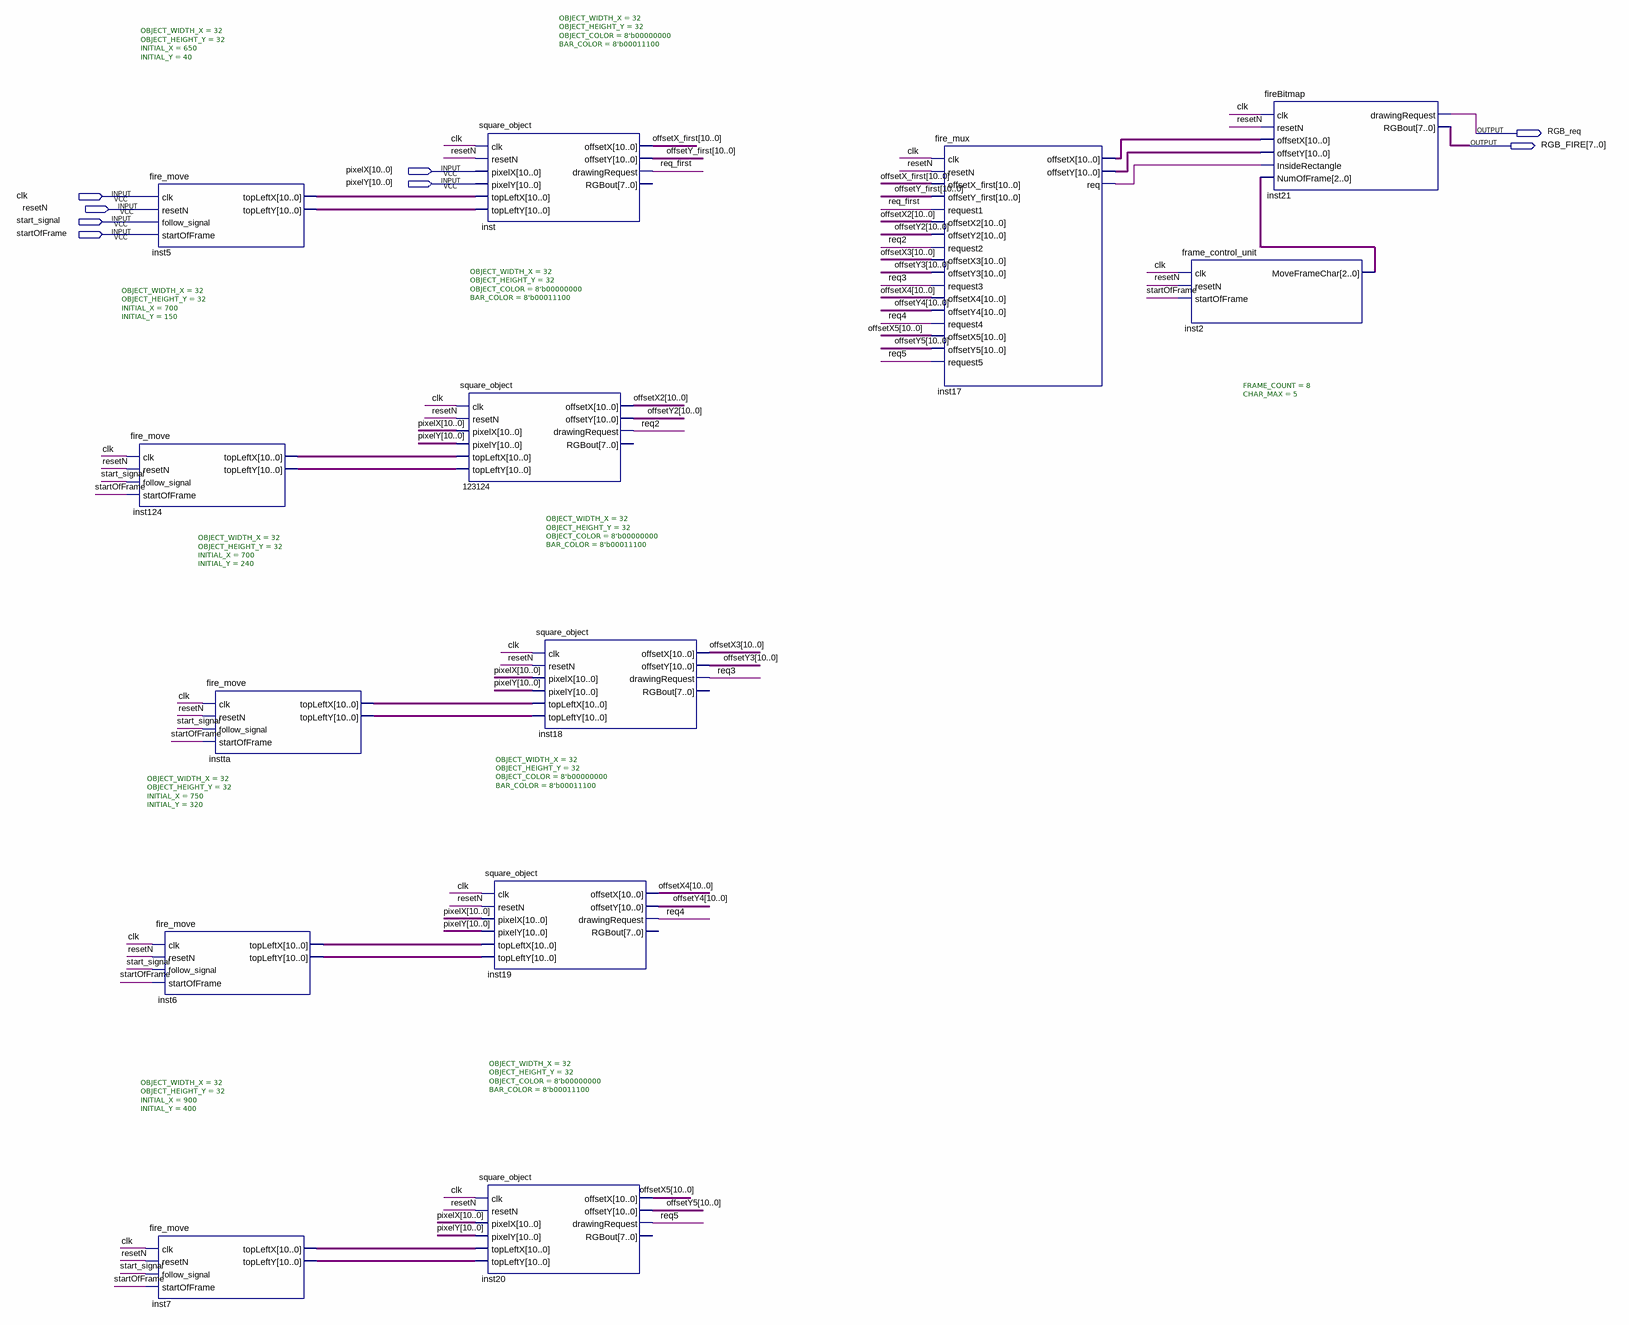
[diagram p0: schematic sheet]
// Quartus schematic fire_top.bdf as structural Verilog: 13 symbols, 8 pins
module fire_top (
  input  [10:0] pixelX,
  input  [10:0] pixelY,
  input  clk,
  input  resetN,
  input  start_signal,
  input  startOfFrame,
  output RGB_req,
  output [7:0] RGB_FIRE
);

  wire inst17_req, req2, req3, req4, req5, req_first;
  wire [2:0] inst2_moveframechar;
  wire [10:0] inst5_topleftx, inst5_toplefty, inst6_topleftx, inst6_toplefty, inst7_topleftx, inst7_toplefty,
       inst17_offsetx, inst17_offsety, inst124_topleftx, inst124_toplefty, instta_topleftx, instta_toplefty,
       offsetX2, offsetX3, offsetX4, offsetX5, offsetX_first, offsetY2, offsetY3, offsetY4, offsetY5,
       offsetY_first;

  fire_move #(.OBJECT_WIDTH_X(32), .OBJECT_HEIGHT_Y(32), .INITIAL_X(650), .INITIAL_Y(40)) inst5 (
    .clk(clk), .follow_signal(start_signal), .startOfFrame(startOfFrame), .topLeftX(inst5_topleftx),
    .topLeftY(inst5_toplefty));  // open: resetN
  fire_move #(.OBJECT_WIDTH_X(32), .OBJECT_HEIGHT_Y(32), .INITIAL_X(700), .INITIAL_Y(150)) inst124 (
    .clk(clk), .resetN(resetN), .follow_signal(start_signal), .startOfFrame(startOfFrame),
    .topLeftX(inst124_topleftx), .topLeftY(inst124_toplefty));
  fire_move #(.OBJECT_WIDTH_X(32), .OBJECT_HEIGHT_Y(32), .INITIAL_X(750), .INITIAL_Y(320)) inst6 (
    .clk(clk), .resetN(resetN), .follow_signal(start_signal), .startOfFrame(startOfFrame),
    .topLeftX(inst6_topleftx), .topLeftY(inst6_toplefty));
  fire_move #(.OBJECT_WIDTH_X(32), .OBJECT_HEIGHT_Y(32), .INITIAL_X(900), .INITIAL_Y(400)) inst7 (
    .clk(clk), .resetN(resetN), .follow_signal(start_signal), .startOfFrame(startOfFrame),
    .topLeftX(inst7_topleftx), .topLeftY(inst7_toplefty));
  fire_move #(.OBJECT_WIDTH_X(32), .OBJECT_HEIGHT_Y(32), .INITIAL_X(700), .INITIAL_Y(240)) instta (
    .clk(clk), .resetN(resetN), .follow_signal(start_signal), .startOfFrame(startOfFrame),
    .topLeftX(instta_topleftx), .topLeftY(instta_toplefty));
  square_object #(.OBJECT_WIDTH_X(32), .OBJECT_HEIGHT_Y(32), .OBJECT_COLOR(8'b00000000), .BAR_COLOR(8'b00011100)) u_123124 (
    .clk(clk), .resetN(resetN), .pixelX(pixelX), .pixelY(pixelY), .topLeftX(inst124_topleftx),
    .topLeftY(inst124_toplefty), .offsetX(offsetX2), .offsetY(offsetY2), .drawingRequest(req2));  // open: RGBout
  square_object #(.OBJECT_WIDTH_X(32), .OBJECT_HEIGHT_Y(32), .OBJECT_COLOR(8'b00000000), .BAR_COLOR(8'b00011100)) inst (
    .clk(clk), .resetN(resetN), .pixelX(pixelX), .pixelY(pixelY), .topLeftX(inst5_topleftx),
    .topLeftY(inst5_toplefty), .offsetX(offsetX_first), .offsetY(offsetY_first), .drawingRequest(req_first));  // open: RGBout
  square_object #(.OBJECT_WIDTH_X(32), .OBJECT_HEIGHT_Y(32), .OBJECT_COLOR(8'b00000000), .BAR_COLOR(8'b00011100)) inst19 (
    .clk(clk), .resetN(resetN), .pixelX(pixelX), .pixelY(pixelY), .topLeftX(inst6_topleftx),
    .topLeftY(inst6_toplefty), .offsetX(offsetX4), .offsetY(offsetY4), .drawingRequest(req4));  // open: RGBout
  square_object #(.OBJECT_WIDTH_X(32), .OBJECT_HEIGHT_Y(32), .OBJECT_COLOR(8'b00000000), .BAR_COLOR(8'b00011100)) inst20 (
    .clk(clk), .resetN(resetN), .pixelX(pixelX), .pixelY(pixelY), .topLeftX(inst7_topleftx),
    .topLeftY(inst7_toplefty), .offsetX(offsetX5), .offsetY(offsetY5), .drawingRequest(req5));  // open: RGBout
  square_object #(.OBJECT_WIDTH_X(32), .OBJECT_HEIGHT_Y(32), .OBJECT_COLOR(8'b00000000), .BAR_COLOR(8'b00011100)) inst18 (
    .clk(clk), .resetN(resetN), .pixelX(pixelX), .pixelY(pixelY), .topLeftX(instta_topleftx),
    .topLeftY(instta_toplefty), .offsetX(offsetX3), .offsetY(offsetY3), .drawingRequest(req3));  // open: RGBout
  fire_mux inst17 (
    .clk(clk), .resetN(resetN), .offsetX_first(offsetX_first), .offsetY_first(offsetY_first),
    .request1(req_first), .offsetX2(offsetX2), .offsetY2(offsetY2), .request2(req2), .offsetX3(offsetX3),
    .offsetY3(offsetY3), .request3(req3), .offsetX4(offsetX4), .offsetY4(offsetY4), .request4(req4),
    .offsetX5(offsetX5), .offsetY5(offsetY5), .request5(req5), .offsetX(inst17_offsetx),
    .offsetY(inst17_offsety), .req(inst17_req));
  frame_control_unit #(.FRAME_COUNT(8), .CHAR_MAX(5)) inst2 (
    .clk(clk), .resetN(resetN), .startOfFrame(startOfFrame), .MoveFrameChar(inst2_moveframechar));
  fireBitmap inst21 (
    .clk(clk), .resetN(resetN), .offsetX(inst17_offsetx), .offsetY(inst17_offsety),
    .InsideRectangle(inst17_req), .NumOfFrame(inst2_moveframechar), .drawingRequest(RGB_req),
    .RGBout(RGB_FIRE));
endmodule
